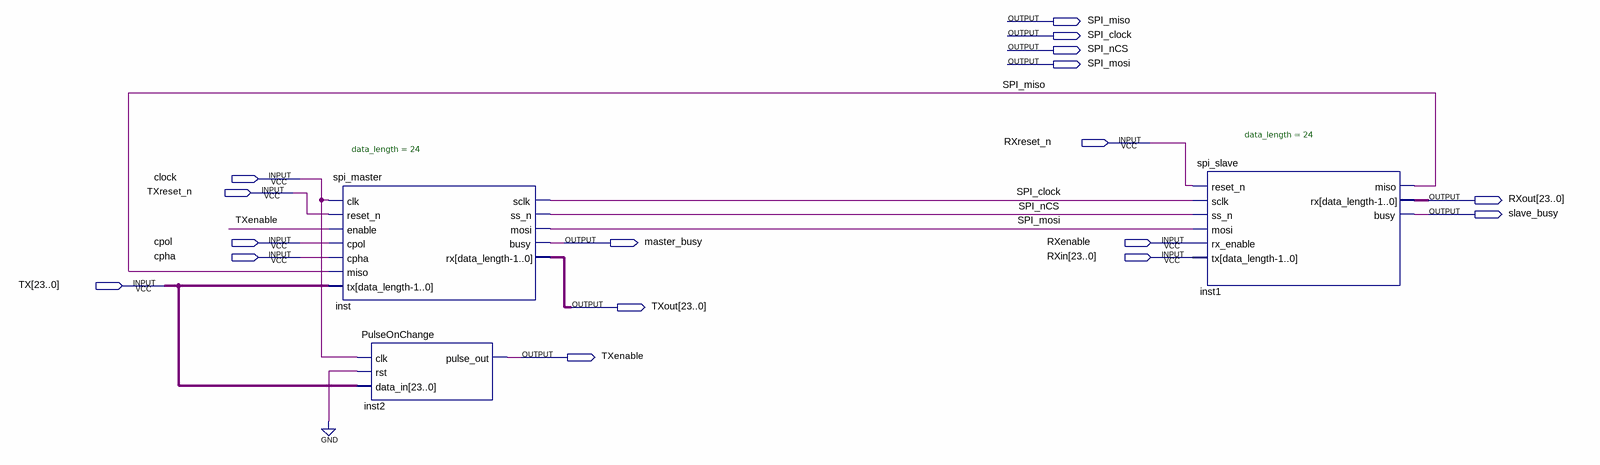
[diagram p0: schematic sheet]
// Quartus schematic SPI_in_out_test.bdf as structural Verilog: 3 symbols, 17 pins
module SPI_in_out_test (
  input  RXreset_n,
  input  clock,
  input  TXreset_n,
  input  cpol,
  input  RXenable,
  input  cpha,
  input  [23:0] RXin,
  input  [23:0] TX,
  output SPI_miso,
  output SPI_clock,
  output SPI_nCS,
  output SPI_mosi,
  output [23:0] RXout,
  output slave_busy,
  output master_busy,
  output [23:0] TXout,
  output TXenable
);

  spi_master #(.data_length(24)) inst (
    .clk(clock), .reset_n(TXreset_n), .enable(TXenable), .cpol(cpol), .cpha(cpha), .miso(SPI_miso), .tx(TX),
    .sclk(SPI_clock), .ss_n(SPI_nCS), .mosi(SPI_mosi), .busy(master_busy), .rx(TXout));
  PulseOnChange inst2 (.clk(clock), .rst(1'b0), .data_in(TX), .pulse_out(TXenable));
  spi_slave #(.data_length(24)) inst1 (
    .reset_n(RXreset_n), .sclk(SPI_clock), .ss_n(SPI_nCS), .mosi(SPI_mosi), .rx_enable(RXenable), .tx(RXin),
    .miso(SPI_miso), .rx(RXout), .busy(slave_busy));
endmodule
